# EAGLE design untitled (EAGLE 9.6.2)
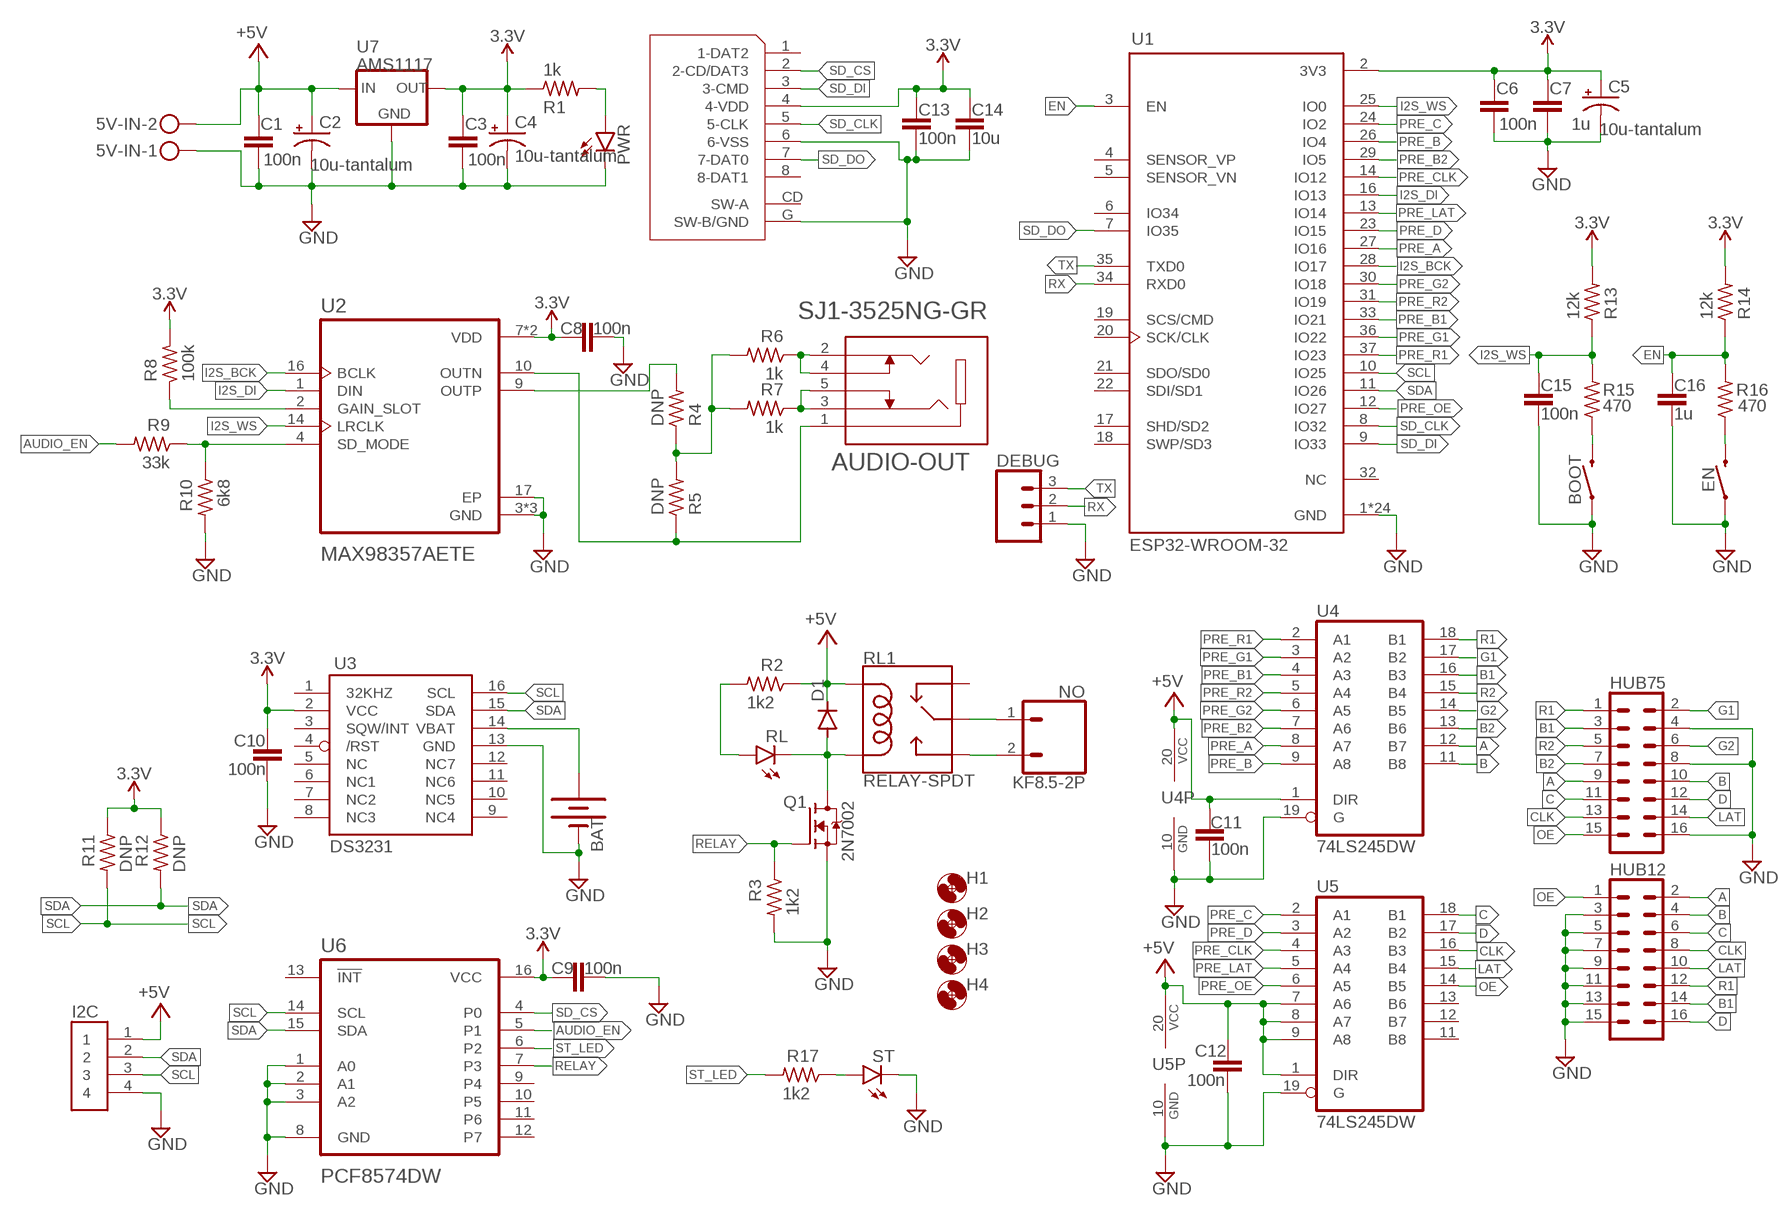
[diagram p0: schematic, sheet 1]

## Parts
5V-IN  MKDSN1,5/2-5,08  [MKDSN1,5/2-5,08]
AUDIO-OUT  SJ1-3525NG-GR  [CUI_SJ1-3525NG-GR]
BAT  BATTERY-20MM_PTH_KIT  [BATTCOM_20MM_PTH_KIT]
BOOT  MOMENTARY-SWITCH-SPST-SMD-6.0X3.5MM  [TACTILE_SWITCH_SMD_6.0X3.5MM]
C1  100n  C-EUC0603K  [C0603K]
C2  10u-tantalum  CPOL-USCT3528  [CT3528]
C3  100n  C-EUC0603K  [C0603K]
C4  10u-tantalum  CPOL-USCT3528  [CT3528]
C5  10u-tantalum  CPOL-USCT3528  [CT3528]
C6  100n  C-EUC0603K  [C0603K]
C7  1u  C-EUC0603K  [C0603K]
C8  100n  C-EUC0603K  [C0603K]
C9  100n  C-EUC0603K  [C0603K]
C10  100n  C-EUC0603K  [C0603K]
C11  100n  C-EUC0603K  [C0603K]
C12  100n  C-EUC0603K  [C0603K]
C13  100n  C-EUC0603K  [C0603K]
C14  10u  C-EUC0603K  [C0603K]
C15  100n  C-EUC0603K  [C0603K]
C16  1u  C-EUC0603K  [C0603K]
D1  DIODE-DO-214AC  [DO-214AC]
DEBUG  CONN_03  [1X03]
EN  MOMENTARY-SWITCH-SPST-SMD-6.0X3.5MM  [TACTILE_SWITCH_SMD_6.0X3.5MM]
H1  MOUNT-HOLE3.2  [3,2]
H2  MOUNT-HOLE3.2  [3,2]
H3  MOUNT-HOLE3.2  [3,2]
H4  MOUNT-HOLE3.2  [3,2]
HUB12  CONN_08X2_SHROUD  [2X8-SHROUDED_LOCK]
HUB75  CONN_08X2_SHROUD  [2X8-SHROUDED_LOCK]
I2C  B4B-XH-A(LF)(SN)  [JST_B4B-XH-A(LF)(SN)]
NO  KF8.5-2P  KF7.62-2P  [KF7.62]
PWR  LEDCHIP-LED0805  [CHIP-LED0805]
Q1  2N7002  [SOT95P240X111-3N]
R1  1k  R-US_R0603  [R0603]
R2  1k2  R-US_R0603  [R0603]
R3  1k2  R-US_R0603  [R0603]
R4  DNP  R-US_R0603  [R0603]
R5  DNP  R-US_R0603  [R0603]
R6  1k  R-US_R0603  [R0603]
R7  1k  R-US_R0603  [R0603]
R8  100k  R-US_R0603  [R0603]
R9  33k  R-US_R0603  [R0603]
R10  6k8  R-US_R0603  [R0603]
R11  DNP  R-US_R0603  [R0603]
R12  DNP  R-US_R0603  [R0603]
R13  12k  R-US_R0603  [R0603]
R14  12k  R-US_R0603  [R0603]
R15  470  R-US_R0603  [R0603]
R16  470  R-US_R0603  [R0603]
R17  1k2  R-US_R0603  [R0603]
RL  LEDCHIP-LED0805  [CHIP-LED0805]
RL1  RELAY-SPDT  [RELAY_G5LE]
ST  LEDCHIP-LED0805  [CHIP-LED0805]
U1  ESP32-WROOM-32  [MODULE_ESP32-WROOM-32]
U2  MAX98357AETE  [QFN50P300X300X80-17N]
U3  DS3231/SO  [SO16W]
U4  74LS245DW  [SO20W]
U5  74LS245DW  [SO20W]
U6  PCF8574DW  [SOIC127P1030X265-16N]
U7  AMS1117  [SOT89R]
μSD  112J-TDAR-R01  [112J-TDAR-R01]

## Nets
3.3V: C3.1 C4.+ C5.+ C6.1 C7.1 C8.1 C9.1 C10.2 C13.2 C14.2 R1.1 R8.2 R11.1 R12.1 R13.2 R14.2 U1.2(3V3) U2.7(VDD) U2.8(VDD) U3.2(VCC) U6.16(VCC) U7.3(OUT) U7.4(OUT) μSD.4(4-VDD)
+5V: 5V-IN.2 C1.1 C2.+ C11.1 C12.2 D1.C I2C.1 R2.1 RL1.2(COIL1) U4.1(DIR) U4.20(VCC) U5.1(DIR) U5.7(A6) U5.8(A7) U5.9(A8) U5.20(VCC) U7.1(IN)
A: HUB12.2 HUB75.9 U4.12(B7)
AUDIO_EN: R9.2 U6.5(P1)
B: HUB12.4 HUB75.10 U4.11(B8)
B1: HUB12.14 HUB75.3 U4.16(B3)
B2: HUB75.7 U4.13(B6)
C: HUB12.6 HUB75.11 U5.18(B1)
CLK: HUB12.8 HUB75.13 U5.16(B3)
D: HUB12.16 HUB75.12 U5.17(B2)
EN: C16.2 R14.1 R16.2 U1.3(EN)
G1: HUB75.2 U4.17(B2)
G2: HUB75.6 U4.14(B5)
GND: 5V-IN.1 BAT.2(-) BOOT.1 C1.2 C2.- C3.2 C4.- C5.- C6.2 C7.2 C8.2 C9.2 C10.1 C11.2 C12.1 C13.1 C14.1 C15.1 C16.1 DEBUG.1 EN.1 HUB12.3 HUB12.5 HUB12.7 HUB12.9 HUB12.11 HUB12.13 HUB12.15 HUB75.4 HUB75.8 HUB75.16 I2C.4 PWR.C Q1.2(S) R3.2 R10.2 ST.C U1.1(GND) U1.15(GND) U1.38(GND) U1.39_1(GND) U1.39_2(GND) U1.39_3(GND) U1.39_4(GND) U1.39_5(GND) U1.39_6(GND) U1.39_7(GND) U1.39_8(GND) U1.39_9(GND) U1.39_10(GND) U1.39_11(GND) U1.39_12(GND) U1.39_13(GND) U1.39_14(GND) U1.39_15(GND) U1.39_16(GND) U1.39_17(GND) U1.39_18(GND) U1.39_19(GND) U1.39_20(GND) U1.39_21(GND) U2.3(GND) U2.11(GND) U2.15(GND) U2.17(EP) U3.13(GND) U4.10(GND) U4.19(G) U5.10(GND) U5.19(G) U6.1(A0) U6.2(A1) U6.3(A2) U6.8(GND) U7.2(GND) μSD.6(6-VSS) μSD.G(SW-B/GND)
I2S_BCK: U1.28(IO17) U2.16(BCLK)
I2S_DI: U1.16(IO13) U2.1(DIN)
I2S_WS: C15.2 R13.1 R15.2 U1.25(IO0) U2.14(LRCLK)
LAT: HUB12.10 HUB75.14 U5.15(B4)
N$1: NO.1 RL1.1(MAIN)
N$2: NO.2 RL1.3(NO)
N$3: R4.2 U2.9(OUTP)
N$4: PWR.A R1.2
N$5: AUDIO-OUT.1 R5.1 U2.10(OUTN)
N$6: R4.1 R5.2 R6.2 R7.2
N$7: R8.1 U2.2(GAIN_SLOT)
N$8: AUDIO-OUT.3 AUDIO-OUT.5 R7.1
N$9: R9.1 R10.1 U2.4(SD_MODE)
N$10: AUDIO-OUT.2 AUDIO-OUT.4 R6.1
N$11: BAT.1(+) U3.14(VBAT)
N$13: EN.2 R16.1
N$14: BOOT.2 R15.1
N$15: R17.1 ST.A
N$61: D1.A Q1.3(D) RL1.5(COIL2) RL.C
N$65: R2.2 RL.A
OE: HUB12.1 HUB75.15 U5.14(B5)
PRE_A: U1.27(IO16) U4.8(A7)
PRE_B: U1.26(IO4) U4.9(A8)
PRE_B1: U1.33(IO21) U4.4(A3)
PRE_B2: U1.29(IO5) U4.7(A6)
PRE_C: U1.24(IO2) U5.2(A1)
PRE_CLK: U1.14(IO12) U5.4(A3)
PRE_D: U1.23(IO15) U5.3(A2)
PRE_G1: U1.36(IO22) U4.3(A2)
PRE_G2: U1.30(IO18) U4.6(A5)
PRE_LAT: U1.13(IO14) U5.5(A4)
PRE_OE: U1.12(IO27) U5.6(A5)
PRE_R1: U1.37(IO23) U4.2(A1)
PRE_R2: U1.31(IO19) U4.5(A4)
R1: HUB12.12 HUB75.1 U4.18(B1)
R2: HUB75.5 U4.15(B4)
RELAY: Q1.1(G) R3.1 U6.7(P3)
RX: DEBUG.2 U1.34(RXD0)
SCL: I2C.3 R11.2 U1.10(IO25) U3.16(SCL) U6.14(SCL)
SD_CLK: U1.8(IO32) μSD.5(5-CLK)
SD_CS: U6.4(P0) μSD.2(2-CD/DAT3)
SD_DI: U1.9(IO33) μSD.3(3-CMD)
SD_DO: U1.7(IO35) μSD.7(7-DAT0)
SDA: I2C.2 R12.2 U1.11(IO26) U3.15(SDA) U6.15(SDA)
ST_LED: R17.2 U6.6(P2)
TX: DEBUG.3 U1.35(TXD0)
Unconnected: RL1.4(NC) U1.4(SENSOR_VP) U1.5(SENSOR_VN) U1.6(IO34) U1.17(SHD/SD2) U1.18(SWP/SD3) U1.19(SCS/CMD) U1.20(SCK/CLK) U1.21(SDO/SD0) U1.22(SDI/SD1) U1.32(NC) U3.1(32KHZ) U3.3(SQW/INT) U3.4(/RST) U3.5(NC) U3.6(NC1) U3.7(NC2) U3.8(NC3) U3.9(NC4) U3.10(NC5) U3.11(NC6) U3.12(NC7) U5.11(B8) U5.12(B7) U5.13(B6) U6.9(P4) U6.10(P5) U6.11(P6) U6.12(P7) U6.13(!INT) μSD.1(1-DAT2) μSD.8(8-DAT1) μSD.CD(SW-A)

## Library data of the parts
5V-IN = con-phoenix-508:MKDSN1,5/2-5,08: MKDSN 1,5/ 2-5,08 Printklemme Nennstrom: 13,5 A Nennspannung: 250 V Rastermaß: 5,08 mm Polzahl: 2 Anschlussart: Schraubanschluss Montage: Löten Anschlussrichtung Leiter/Platine: 0 ° Artikelnummer: 1729128 Source: http://eshop.phoenixcontact.com .. 1729128.pdf
AUDIO-OUT = SJ1-3525NG-GR:SJ1-3525NG-GR: 3.5 mm Right-Angle Stereo Jack, 5 Pin PCB Mount, Isolated Ground, Green Check availability <https://pricing.snapeda.com/parts/SJ1-3525NG-GR/CUI%20Devices/view-part?ref=eda>; AVAILABILITY: In Stock; CUI_PURCHASE_URL: https://www.cuidevices.com/product/interconnect/connectors/audio-connectors/jacks/sj1-352xng-series?utm_source=snapeda.com&utm_medium=referral&utm_campaign=snapedaBOM; DESCRIPTION: 3.5 mm, Stereo, Right Angle, Through Hole, Isolated Ground, 3 Conductors, 0~2 Internal Switches, Audio Jack Connector; MF: CUI Devices; MP: SJ1-3525NG-GR; PACKAGE: None; PRICE: None; PURCHASE-URL: https://pricing.snapeda.com/search/part/SJ1-3525NG-GR/?ref=eda
BAT = SparkFun-Batteries:BATTERY: Battery - Single Cell A variety of battery chemistries, sizes, and footprints. Device List: 20MM_PTH - Coin Cell Battery Holder - 20mm (PTH) <https://www.sparkfun.com/products/783> 20MM_PTH_KIT- Coin Cell battery Holder - 20 mm (PTH) <http://www.sparkfun.com/products/783>kit version with special mask 6.8MM_PTH - Coin Cell Battery Holder - 6.8MM(SMD) <https://www.digikey.com/product-detail/en/seiko-instruments/MS621FE-FL11E/728-1057-ND/1889208?WT.srch=1&gclid=CNOQ5a6LzdQCFZS2wAodXCkE0g> 12MM_SMD - Coin Cell Battery Holder - 12mm (SMD) <https://www.sparkfun.com/products/10592> 12MM_PTH - Coin Cell Battery Holder - 12mm (PTH) <https://www.sparkfun.com/products/7948> 20MM_SMD - 20mm Coin Cell Battery Holder (SMD) (2 legs) Used on the Big Time Watch Kit <https://www.sparkfun.com/products/11734> 20MM_SMD_4LEGS - Coin Cell Battery Holder - 20mm (SMD) <https://www.sparkfun.com/products/11892> 20MM_SMD_4LEGS_OVERPASTE - Coin Cell Battery Holder - 20mm (SMD) <https://www.sparkfun.com/products/11892> (Over-paste on the legs) 24.5MM_PTH - Coin Cell Battery Holder - 24.5mm (PTH) <https://www.sparkfun.com/products/8863> 9V - 9V Battery Holder - PC Mount Used on the SparkFun SparkPunk Sound Kit <https://www.sparkfun.com/products/11177> and SparkFun SparkPunk Sequencer Kit <https://www.sparkfun.com/products/12707> 18650 - Battery Holder - 18650 (PTH) <https://www.sparkfun.com/products/13113> AA - Battery Holder - 1xAA (PTH) <https://www.sparkfun.com/products/7949> AAA - Battery Holder - 1xAAA (PTH) <https://www.sparkfun.com/products/12718> AA_KIT - Battery Holder - 1xAA (PTH) <https://www.sparkfun.com/products/7949> Special kit package - pads only have exposed copper on one side of the board. AAA_KIT - Battery Holder - 1xAAA (PTH) <https://www.sparkfun.com/products/12718> Special kit package - pads only have exposed copper on one side of the board.
BOOT EN = SparkFun-Switches:MOMENTARY-SWITCH-SPST: Momentary Switch (Pushbutton) - SPST Normally-open (NO) SPST momentary switches (buttons, pushbuttons). Variants PTH-12MM - 12mm square, through-hole Momentary Pushbutton Switch - 12mm Square <https://www.sparkfun.com/products/9190> (COM-09190) PTH-6.0MM, PTH-6.0MM-KIT - 6.0mm square, through-hole Mini Pushbutton Switch <https://www.sparkfun.com/products/97> (COM-00097) KIT package intended for soldering kit's - only one side of pads' copper is exposed. PTH-RIGHT-ANGLE-KIT - Right-angle, through-hole Right Angle Tactile Button <https://www.sparkfun.com/products/10791> - Used on SparkFun BigTime Watch Kit <https://www.sparkfun.com/products/11734> SMD-12MM - 12mm square, surface-mount Tactile Button - SMD (12mm) <https://www.sparkfun.com/products/12993> (COM-12993) Used on SparkFun PicoBoard <https://www.sparkfun.com/products/11888> SMD-4.5MM - 4.5mm Square Trackball Switch Used on SparkFun Blackberry Trackballer Breakout <https://www.sparkfun.com/products/13169> SMD-4.6MMX2.8MM - 4.60mm x 2.80mm, surface mount Used on SparkFun Pro Micro - RP2040 <https://www.sparkfun.com/products/17717> SMD-5.2MM, SMD-5.2-REDUNDANT - 5.2mm square, surface-mount Mini Pushbutton Switch - SMD <https://www.sparkfun.com/products/8720> (COM-08720) Used on Arduino Pro Mini <https://www.sparkfun.com/products/11114> REDUNDANT package connects both switch circuits together SMD-6.0X3.5MM - 6.0 x 3.5mm, surface mount Momentary Reset Switch SMD <https://www.sparkfun.com/products/8229> (COM-08229) SMD-6.2MM-TALL - 6.2mm square, surface mount Tactile Button - SMD (6mm) <https://www.sparkfun.com/products/12992> Used on SparkFun Digital Sandbox <https://www.sparkfun.com/products/12651> SMD-RIGHT-ANGLE - Right-angle, surface mount Used on SparkFun Block for Intel® Edison - Arduino <https://www.sparkfun.com/products/13036>; PROD_ID: SWCH-14278; SF_SKU: COM-08229
C1 C3 C6-C16 = rcl:C-EU: CAPACITOR, European symbol; SPICEPREFIX: C
C2 C4 C5 = rcl:CPOL-US: POLARIZED CAPACITOR, American symbol; SPICEPREFIX: C
D1 = diode:DIODE-: DIODE
DEBUG = SparkFun-Connectors:CONN_03: Multi connection point. Often used as Generic Header-pin footprint for 0.1 inch spaced/style header connections On any of the 0.1 inch spaced packages, you can populate with these: Break Away Headers - Straight <https://www.sparkfun.com/products/116> (PRT-00116) Break Away Male Headers - Right Angle <https://www.sparkfun.com/products/553> (PRT-00553) Female Headers <https://www.sparkfun.com/products/115> (PRT-00115) Break Away Headers - Machine Pin <https://www.sparkfun.com/products/117> (PRT-00117) Break Away Female Headers - Swiss Machine Pin <https://www.sparkfun.com/products/743> (PRT-00743) Stackable Header - 3 Pin (Female, 0.1") <https://www.sparkfun.com/products/13875> (PRT-13875) For SCREWTERMINALS and SPRING TERMINALS visit here: Screw Terimnals on SparkFun.com <https://www.sparkfun.com/search/results?term=Screw+Terminals> (5mm/3.5mm/2.54mm spacing) This device is also useful as a general connection point to wire up your design to another part of your project. Our various solder wires solder well into these plated through hole pads. Hook-Up Wire - Assortment (Stranded, 22 AWG) <https://www.sparkfun.com/products/11375> (PRT-11375) Hook-Up Wire - Assortment (Solid Core, 22 AWG) <https://www.sparkfun.com/products/11367> (PRT-11367) View the entire wire category on our website here <https://www.sparkfun.com/categories/141> Special notes: Molex polarized connector foot print use with SKU : PRT-08232 with associated crimp pins and housings.; PROD_ID: XXX-00000; VALUE: 455-1750-1-ND
H1-H4 = holes:MOUNT-HOLE: MOUNTING HOLE with drill center marker
HUB12 = SparkFun-Connectors:CONN_08X2: Multi connection point. Often used as Generic Header-pin footprint for 0.1 inch spaced/style header connections You can populate with any combo of single row headers, but if you'd like an exact match, check this: Header - 2x8 (Male, 0.1") <https://www.sparkfun.com/products/13156> (PRT-13156) On any of the 0.1 inch spaced packages, you can populate with these: Break Away Headers - Straight <https://www.sparkfun.com/products/116> (PRT-00116) Break Away Male Headers - Right Angle <https://www.sparkfun.com/products/553> (PRT-00553) Female Headers <https://www.sparkfun.com/products/115> (PRT-00115) Break Away Headers - Machine Pin <https://www.sparkfun.com/products/117> (PRT-00117) Break Away Female Headers - Swiss Machine Pin <https://www.sparkfun.com/products/743> (PRT-00743)
HUB75 = SparkFun-Connectors:CONN_08X2: Multi connection point. Often used as Generic Header-pin footprint for 0.1 inch spaced/style header connections You can populate with any combo of single row headers, but if you'd like an exact match, check this: Header - 2x8 (Male, 0.1") <https://www.sparkfun.com/products/13156> (PRT-13156) On any of the 0.1 inch spaced packages, you can populate with these: Break Away Headers - Straight <https://www.sparkfun.com/products/116> (PRT-00116) Break Away Male Headers - Right Angle <https://www.sparkfun.com/products/553> (PRT-00553) Female Headers <https://www.sparkfun.com/products/115> (PRT-00115) Break Away Headers - Machine Pin <https://www.sparkfun.com/products/117> (PRT-00117) Break Away Female Headers - Swiss Machine Pin <https://www.sparkfun.com/products/743> (PRT-00743); SPICEPREFIX: X
I2C = hotberry:B4B-XH-A(LF)(SN): XH Series 4 Position 2.5 mm Pitch Through Hole Crimp Top Entry Shrouded Header; MANUFACTURER: JST Sales America Inc; PARTREV: NA; STANDARD: Manufacturer Recommendation
NO = SparkFun-Connectors:KF7.62-2P
PWR RL ST = led:LED: LED OSRAM: - CHIPLED LG R971, LG N971, LY N971, LG Q971, LY Q971, LO R971, LY R971 LH N974, LH R974 LS Q976, LO Q976, LY Q976 LO Q996 - Hyper CHIPLED LW Q18S LB Q993, LB Q99A, LB R99A - SideLED LS A670, LO A670, LY A670, LG A670, LP A670 LB A673, LV A673, LT A673, LW A673 LH A674 LY A675 LS A676, LA A676, LO A676, LY A676, LW A676 LS A679, LY A679, LG A679 - Hyper Micro SIDELED® LS Y876, LA Y876, LO Y876, LY Y876 LT Y87S - SmartLED LW L88C, LW L88S LB L89C, LB L89S, LG L890 LS L89K, LO L89K, LY L89K LS L896, LA L896, LO L896, LY L896 - TOPLED LS T670, LO T670, LY T670, LG T670, LP T670 LSG T670, LSP T670, LSY T670, LOP T670, LYG T670 LG T671, LOG T671, LSG T671 LB T673, LV T673, LT T673, LW T673 LH T674 LS T676, LA T676, LO T676, LY T676, LB T676, LH T676, LSB T676, LW T676 LB T67C, LV T67C, LT T67C, LS T67K, LO T67K, LY T67K, LW E67C LS E67B, LA E67B, LO E67B, LY E67B, LB E67C, LV E67C, LT E67C LW T67C LS T679, LY T679, LG T679 LS T770, LO T770, LY T770, LG T770, LP T770 LB T773, LV T773, LT T773, LW T773 LH T774 LS E675, LA E675, LY E675, LS T675 LS T776, LA T776, LO T776, LY T776, LB T776 LHGB T686 LT T68C, LB T68C - Hyper Mini TOPLED® LB M676 - Mini TOPLED Santana® LG M470 LS M47K, LO M47K, LY M47K Source: http://www.osram.convergy.de LUXEON: - LUMILED® LXK2-PW12-R00, LXK2-PW12-S00, LXK2-PW14-U00, LXK2-PW14-V00 LXK2-PM12-R00, LXK2-PM12-S00, LXK2-PM14-U00 LXK2-PE12-Q00, LXK2-PE12-R00, LXK2-PE12-S00, LXK2-PE14-T00, LXK2-PE14-U00 LXK2-PB12-K00, LXK2-PB12-L00, LXK2-PB12-M00, LXK2-PB14-N00, LXK2-PB14-P00, LXK2-PB14-Q00 LXK2-PR12-L00, LXK2-PR12-M00, LXK2-PR14-Q00, LXK2-PR14-R00 LXK2-PD12-Q00, LXK2-PD12-R00, LXK2-PD12-S00 LXK2-PH12-R00, LXK2-PH12-S00 LXK2-PL12-P00, LXK2-PL12-Q00, LXK2-PL12-R00 Source: www.luxeon.com KINGBRIGHT: KA-3528ASYC Source: www.kingbright.com
Q1 = hotberry:2N7002: N-Channel 60V 280mA (Ta) 350mW (Ta) Surface Mount SOT-23-3 (TO-236) Check availability <https://pricing.snapeda.com/parts/2N7002/ON%20Semiconductor/view-part?ref=eda>; AVAILABILITY: In Stock; DESCRIPTION: N-Channel 60V 280mA (Ta) 350mW (Ta) Surface Mount SOT-23-3 (TO-236); MF: ON Semiconductor; MP: 2N7002; PACKAGE: SOT-23-3 ON Semiconductor; PRICE: None; PURCHASE-URL: https://pricing.snapeda.com/search/part/2N7002/?ref=eda
R1-R17 = rcl:R-US_: RESISTOR, American symbol; SPICEPREFIX: R
RL1 = SparkFun-Electromechanical:RELAY-SPDT: SPDT Electromechanical Relay Single-pole, double-throw sealed relays. When current is applied to the coil, it throws a simple changeover switch, terminating the connection from the NC contact to ground and closing the NO contact. Use them to switch high voltage/high current devices. SparkFun Products JQX-15F: Relay SPDT Sealed - 20A <https://www.sparkfun.com/products/10924> (COM-10924) JZC-11F: Relay SPDT Sealed <https://www.sparkfun.com/products/100> (COM-00100); PROD_ID: COMP-14214
U1 = Mynd:ESP32-WROOM-32; MANUFACTURER: Espressif Systems; MAXIMUM_PACKAGE_HEIGHT: 3.2 mm; PARTREV: 2.9; STANDARD: Manufacturer Recommendations
U2 = Mynd:MAX98357AETE: None; AVAILABILITY: Unavailable; DESCRIPTION: Audio Amp Speaker 1-CH Mono Class-D 16-Pin TQFN EP T/R; MF: Maxim Integrated; MP: MAX98357AETE; PACKAGE: TQFN-16 Maxim; PRICE: None
U3 = Mynd:DS3231
U4 U5 = 74xx-us:74*245: Octal BUS TRANSCEIVER, 3-state
U6 = PCF8574DW:PCF8574DW: Check availability <https://pricing.snapeda.com/parts/PCF8574DW/Texas%20Instruments/view-part?ref=eda>; AVAILABILITY: In Stock; DESCRIPTION: Remote 8-Bit I/O Expander for I2C-Bus 16-SOIC -40 to 85; MF: Texas Instruments; MP: PCF8574DW; PACKAGE: SOIC-16 Texas Instruments; PRICE: None; PURCHASE-URL: https://pricing.snapeda.com/search/part/PCF8574DW/?ref=eda
U7 = v-reg:AMS1117
μSD = Mynd:112J-TDAR-R01

## Board
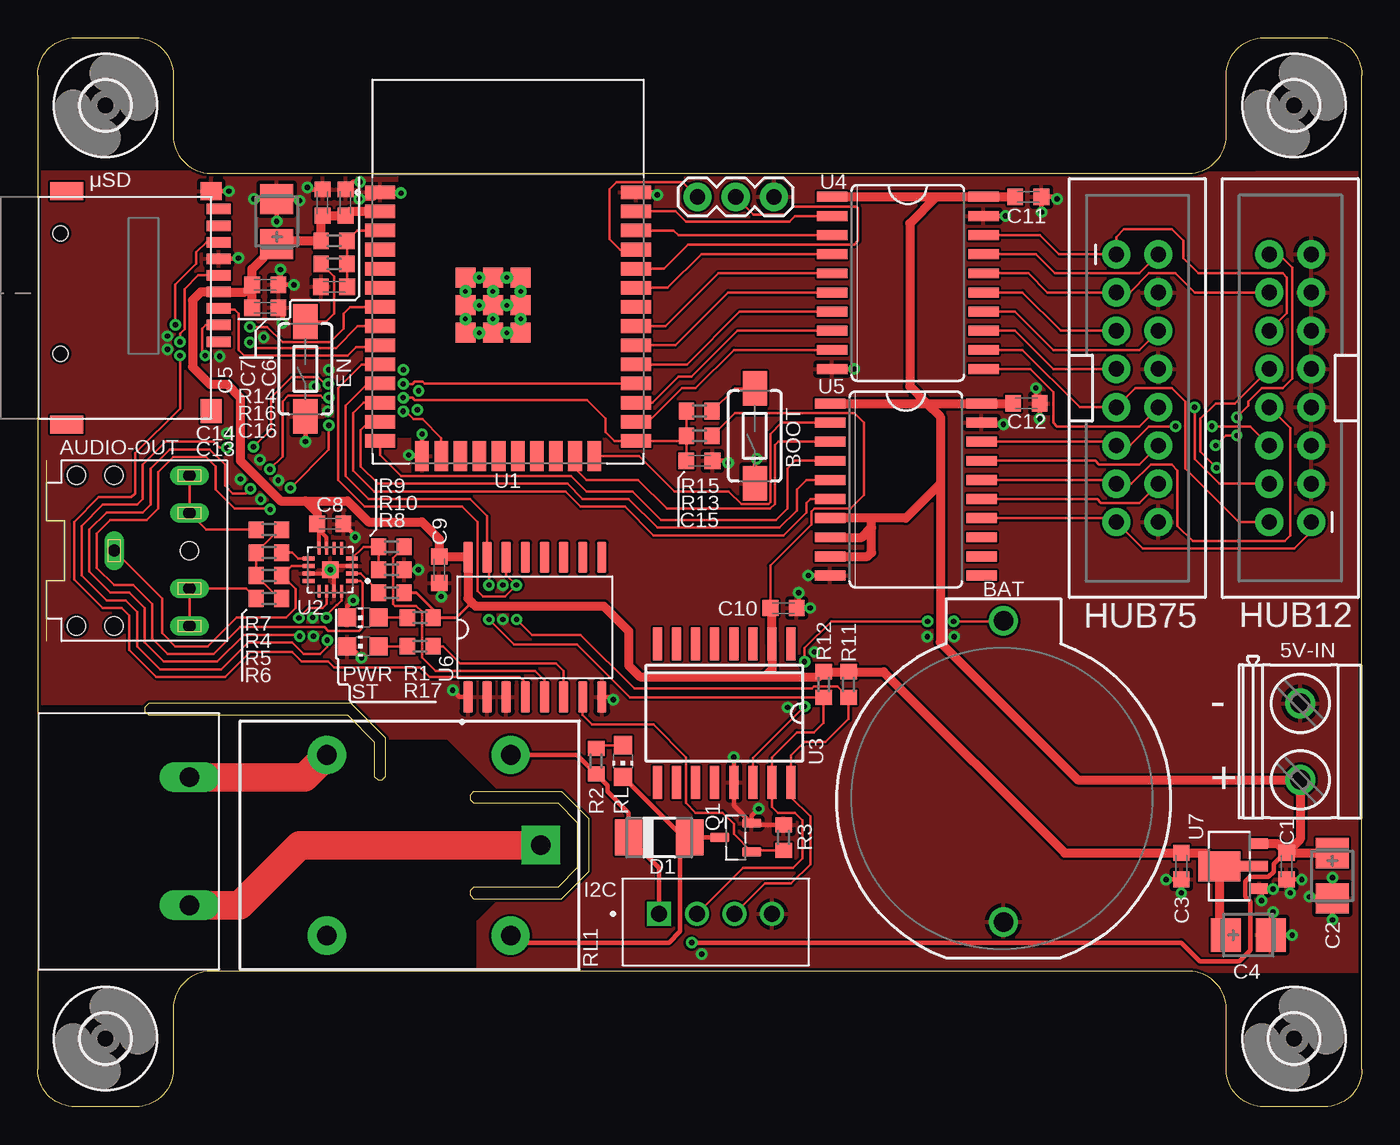
[diagram p1: board, top side]
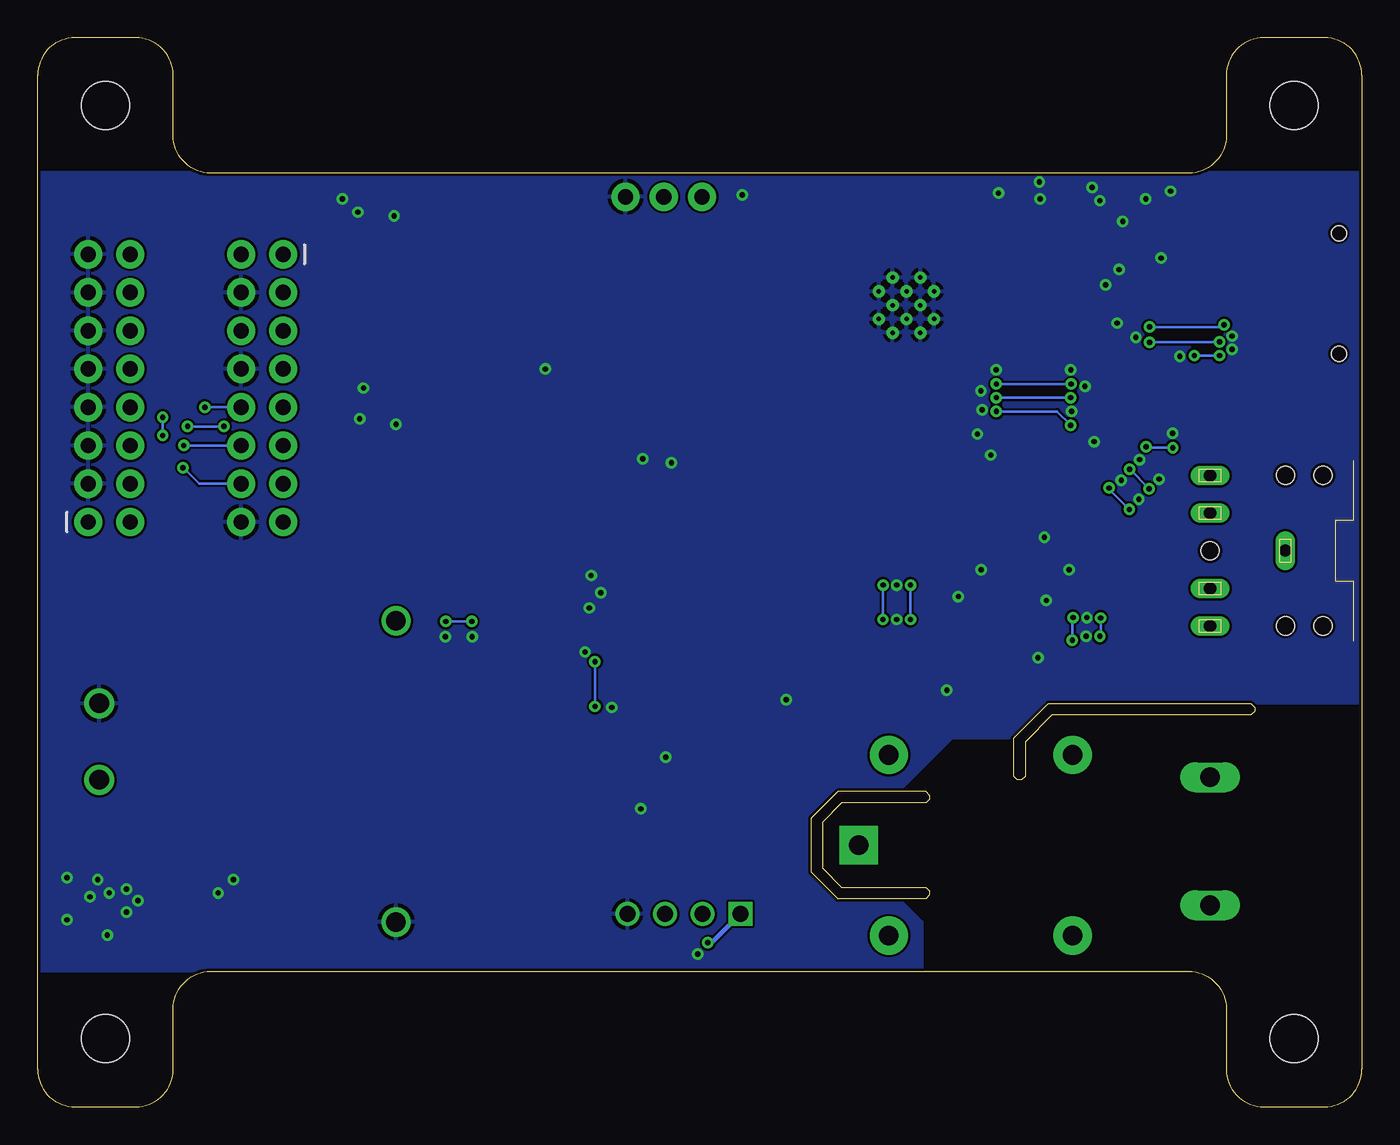
[diagram p2: board, bottom side, seen from below]

Size 87.94 x 71.01 mm. Coordinates in mm from the lower left corner, seen from the top.
Outline: 78.94,2.5 78.94,6.5 arc90 76.44,9 11.5,9 arc90 9,6.5 9,2.5 arc-90 6.5,0 2.5,0 arc-90 0,2.5 0,68.51 arc-90 2.5,71.01 6.5,71.01 arc-90 9,68.51 9,64.51 arc90 11.5,62.01 76.44,62.01 arc90 78.94,64.51 78.94,68.51 arc-90 81.44,71.01 85.44,71.01 arc-90 87.94,68.51 87.94,2.5 arc-90 85.44,0 81.44,0 arc-90 78.94,2.5
Outline: 7.37,26.02 20.57,26.02 22.35,24.24 22.35,21.95 22.61,21.7 22.86,21.7 23.11,21.95 23.11,24.49 20.83,26.78 7.37,26.78 7.11,26.53 7.11,26.27 7.37,26.02
Outline: 28.96,20.94 34.8,20.94 36.58,19.16 36.58,15.6 34.8,13.83 28.96,13.83 28.7,14.08 28.7,14.33 28.96,14.59 34.54,14.59 35.81,15.86 35.81,18.91 34.54,20.18 28.96,20.18 28.7,20.43 28.7,20.68 28.96,20.94
Copper layers (1*16): Top 0.035mm / dielectric 1.5mm / Bottom 0.035mm
Design rules "nextpcb *": minimum track width 6mil, minimum drill 0.3mm, track to track 6mil, track to pad 6mil, pad to pad 6mil, via to via 6mil, smd to smd 0mil, copper to edge 8mil, drill to drill 6mil, minimum pad ring 10mil, minimum via ring 8mil, stop-mask expansion 4mil, vias tented up to drill 25mil, thermal gap 10mil

### Footprints (pad centres in the part's own frame; a part is rotated, then mirrored left to right if it is on the bottom)
MKDSN1,5/2-5,08 = drill 1.3 pad 2: 1 -2.561,0.025; 2 2.519,0.025
CUI_SJ1-3525NG-GR = drill 0.8 long: 1 0,0; 2 5,-5; 3 5,5; 4 5,-2.5; 5 5,2.5 | hole 1.2: -2.5,5; 0,5; 5,0; -2.5,-5; 0,-5
BATTCOM_20MM_PTH_KIT = drill 1.3: 1 11.85,0; 2 -8.15,0
TACTILE_SWITCH_SMD_6.0X3.5MM = smd 2.3 x 1.6: 1 -3.15,0; 2 3.15,0
C0603K = smd 1.05 x 1.08: 1 -0.875,0; 2 0.875,0
CT3528 = smd 2 x 2.2: + -1.5,0; - 1.5,0
DO-214AC = smd 1.8 x 2.4: A 2.025,0; C -2.025,0
1X03 = drill 1.016 pad 1.88: 1 0,0; 2 2.54,0; 3 5.08,0
3,2 = hole 3.2: 0,0
2X8-SHROUDED_LOCK = drill 1.016 pad 1.88: 1 -1.397,8.89; 2 1.397,8.89; 3 -1.397,6.35; 4 1.397,6.35; 5 -1.397,3.81; 6 1.397,3.81; 7 -1.397,1.27; 8 1.397,1.27; 9 -1.397,-1.27; 10 1.397,-1.27; 11 -1.397,-3.81; 12 1.397,-3.81; 13 -1.397,-6.35; 14 1.397,-6.35; 15 -1.397,-8.89; 16 1.397,-8.89
JST_B4B-XH-A(LF)(SN) = drill 1.06 square: 1 0,0 | drill 1.06: 2 2.5,0; 3 5,0; 4 7.5,0
KF7.62 = drill 1.3 pad 2 long: 1 -4.25,-5.75; 2 4.25,-5.75
CHIP-LED0805 = smd 1.2 x 1.2: A 0,-1.05; C 0,1.05
SOT95P240X111-3N = smd 1.23 x 0.6: 1 -1.06,0.95; 2 -1.06,-0.95; 3 1.06,0
R0603 = smd 1 x 1.1: 1 -0.85,0; 2 0.85,0
RELAY_G5LE = drill 1.3 pad 2.54 square: 1 8.52,-0.005 | drill 1.3 pad 2.54: 2 6.52,5.995; 3 -5.68,5.995; 4 -5.68,-6.005; 5 6.52,-6.005
MODULE_ESP32-WROOM-32 = smd 2 x 0.9: 1 -8.5,5.26; 2 -8.5,3.99; 3 -8.5,2.72; 4 -8.5,1.45; 5 -8.5,0.18; 6 -8.5,-1.09; 7 -8.5,-2.36; 8 -8.5,-3.63; 9 -8.5,-4.9; 10 -8.5,-6.17; 11 -8.5,-7.44; 12 -8.5,-8.71; 13 -8.5,-9.98; 14 -8.5,-11.25; 25 8.5,-11.25; 26 8.5,-9.98; 27 8.5,-8.71; 28 8.5,-7.44; 29 8.5,-6.17; 30 8.5,-4.9; 31 8.5,-3.63; 32 8.5,-2.36; 33 8.5,-1.09; 34 8.5,0.18; 35 8.5,1.45; 36 8.5,2.72; 37 8.5,3.99; 38 8.5,5.26 | smd 0.9 x 2: 15 -5.715,-12.25; 16 -4.445,-12.25; 17 -3.175,-12.25; 18 -1.905,-12.25; 19 -0.635,-12.25; 20 0.635,-12.25; 21 1.905,-12.25; 22 3.175,-12.25; 23 4.445,-12.25; 24 5.715,-12.25 | smd 1.33 x 1.33: 39_1 -2.835,-0.405; 39_2 -1,-0.405; 39_3 0.835,-0.405; 39_4 -2.835,-2.24; 39_5 -1,-2.24; 39_6 0.835,-2.24; 39_7 -2.835,-4.075; 39_8 -1,-4.075; 39_9 0.835,-4.075 | drill 0.3 pad 0.61: 39_10 -1.917,-0.405; 39_11 -0.083,-0.405; 39_12 -2.835,-1.323; 39_13 -1,-1.323; 39_14 0.835,-1.323; 39_15 -1.917,-2.24; 39_16 -0.083,-2.24; 39_17 -2.835,-3.158; 39_18 -1,-3.158; 39_19 0.835,-3.158; 39_20 -1.917,-4.075; 39_21 -0.083,-4.075
QFN50P300X300X80-17N = smd 0.84 x 0.27: 1 -1.435,0.75; 2 -1.435,0.25; 3 -1.435,-0.25; 4 -1.435,-0.75; 9 1.435,-0.75; 10 1.435,-0.25; 11 1.435,0.25; 12 1.435,0.75 | smd 0.27 x 0.84: 5 -0.75,-1.435; 6 -0.25,-1.435; 7 0.25,-1.435; 8 0.75,-1.435; 13 0.75,1.435; 14 0.25,1.435; 15 -0.25,1.435; 16 -0.75,1.435 | smd 1.1 x 1.1: 17 0,0
SO16W = smd 0.6 x 2.2: 1 -4.445,-4.6; 2 -3.175,-4.6; 3 -1.905,-4.6; 4 -0.635,-4.6; 5 0.635,-4.6; 6 1.905,-4.6; 7 3.175,-4.6; 8 4.445,-4.6; 9 4.445,4.6; 10 3.175,4.6; 11 1.905,4.6; 12 0.635,4.6; 13 -0.635,4.6; 14 -1.905,4.6; 15 -3.175,4.6; 16 -4.445,4.6
SO20W = smd 0.66 x 2.032: 1 -5.715,-5.029; 2 -4.445,-5.029; 3 -3.175,-5.029; 4 -1.905,-5.029; 5 -0.635,-5.029; 6 0.635,-5.029; 7 1.905,-5.029; 8 3.175,-5.029; 9 4.445,-5.029; 10 5.715,-5.029; 11 5.715,5.029; 12 4.445,5.029; 13 3.175,5.029; 14 1.905,5.029; 15 0.635,5.029; 16 -0.635,5.029; 17 -1.905,5.029; 18 -3.175,5.029; 19 -4.445,5.029; 20 -5.715,5.029
SOIC127P1030X265-16N = smd 2.06 x 0.6: 1 -4.64,4.445; 2 -4.64,3.175; 3 -4.64,1.905; 4 -4.64,0.635; 5 -4.64,-0.635; 6 -4.64,-1.905; 7 -4.64,-3.175; 8 -4.64,-4.445; 9 4.64,-4.445; 10 4.64,-3.175; 11 4.64,-1.905; 12 4.64,-0.635; 13 4.64,0.635; 14 4.64,1.905; 15 4.64,3.175; 16 4.64,4.445
SOT89R = smd 0.7 x 1.1: 1 1.5,-1.75; 2 -1.5,-1.75 | smd 0.7 x 1.8: 3 0,-1.4 | smd 2 x 2.8: 4 0,0.9
112J-TDAR-R01 = smd 0.7 x 1.6: 1 7.2,10.5; 2 6.1,10.5; 3 5,10.5; 4 3.9,10.5; 5 2.8,10.5; 6 1.7,10.5; 7 0.6,10.5; 8 -0.5,10.5; CD -1.6,10.5 | smd 1.2 x 1.4: G -2.8,10 | smd 1.6 x 1.4: P$10 11.8,10 | smd 1.2 x 2.2: P$11 -2.8,0.4; P$12 12.7,0.4 | hole 1: 0,0; 8,0

### Placement (x,y rotation side)
5V-IN  83.82,24.24 270 top
AUDIO-OUT  5.08,36.94 0 top
BAT  64.13,20.43 90 top
BOOT  47.62,44.56 90 top
C1  82.93,15.98 270 top
C2  85.98,15.35 270 top
C3  75.95,15.98 270 top
C4  80.39,11.41 0 top
C5  15.88,58.78 90 top
C6  20.45,60.05 90 top
C7  18.92,60.05 90 top
C8  19.43,38.72 0 top
C9  26.67,35.67 270 top
C10  49.53,33.13 180 top
C11  65.79,60.43 0 top
C12  65.66,46.72 180 top
C13  15.11,53.07 180 top
C14  15.11,54.59 180 top
C15  43.94,42.91 180 top
C16  19.68,54.47 0 top
D1  41.27,17.89 0 top
DEBUG  48.89,60.43 180 top
EN  17.78,49 90 top
H1  4.5,66.51 0 top
H2  83.44,66.51 0 top
H3  4.5,4.53 0 top
H4  83.44,4.53 0 top
HUB12  83.19,47.73 180 top
HUB75  73.03,47.73 0 top
I2C  41.27,12.81 0 top
NO  4.32,17.64 90 top
PWR  21.59,32.49 90 top
Q1  46.35,17.89 180 top
R1  25.4,32.49 180 top
R2  37.08,22.97 90 top
R3  49.53,17.89 90 top
R4  15.37,36.81 0 top
R5  15.37,35.29 180 top
R6  15.37,33.76 0 top
R7  15.37,38.34 0 top
R8  23.5,34.15 0 top
R9  23.5,37.19 0 top
R10  23.5,35.67 0 top
R11  53.85,28.05 270 top
R12  52.2,28.05 270 top
R13  43.94,44.56 0 top
R14  19.68,57.51 180 top
R15  43.94,46.21 180 top
R16  19.68,55.99 0 top
R17  25.4,30.59 0 top
RL  38.86,22.97 180 top
RL1  24.89,17.38 0 top
ST  21.59,30.59 90 top
U1  31.24,55.48 0 top
U2  19.43,35.67 180 top
U3  45.59,26.14 180 top
U4  57.78,54.72 270 top
U5  57.66,41 270 top
U6  33.02,31.86 90 top
U7  79.38,15.98 90 top
μSD  1.52,58.02 270 top

### Tracks (layer width: path | path; a pad name or v marks a point on that pad's centre or on a via)
3.3V
  Top 0.152: R13.2 46.32,46.08 54.23,46.08 54.86,45.45 54.86,40.62 53.98,39.73 51.59,39.73 51.38,39.52 51.38,38.67 48.66,35.94 C10.2
  Top 0.203: R8.2 25.15,34.15 26.25,33.04 R1.1 27.81,32.49 28.83,33.51
  Top 0.254: U2.8 18.68,38.32 | C8.1 18.68,38.59 18.68,38.32 | U2.7 19.18,37.82 18.68,38.32
  Top 0.61: C14.2 13.77,54.12 μSD.4 10.83,54.12 10.29,53.58 10.29,49.13 11.43,47.99 12.57,47.99 13.46,47.1 13.46,42.91 16.13,40.24 17.78,40.24 | C13.2 C14.2 | C14.2 14.24,55.65 C5.+ 16.11,57.51 R14.2 18.84,59.09 C7.1 C6.1 20.74,59.47 U1.2 | 17.78,40.24 18.56,39.47 C8.1 | 17.78,40.24 20.57,40.24 21.97,38.84 25.53,38.84 26.67,37.7 C9.1 28.53,36.54 U6.16 28.57,33.76 28.83,33.51 29.08,33.26 37.59,33.26 39.24,31.61 39.24,29.32 40.01,28.56 48.26,28.56 | 48.26,28.56 48.77,29.07 U3.2 48.77,33.02 C10.2 | 48.26,28.56 51.86,28.56 R12.1 R11.1 56.17,28.9 68.21,16.86 C3.1 77.6,16.86 U7.4 | U7.4 78.47,11.83 C4.+ | U7.3 U7.4
+5V  (via drill 0.35)
  Top 0.305: I2C.1 41.27,15.86 D1.C 39.25,19.53 37.85,20.94 37.85,21.36 R2.1 35.83,23.38 RL1.2 | v43.43,10.9 75.95,10.9 77.19,9.66 79.78,9.66 80.52,10.4 80.52,13.63 80.19,13.96 80.19,14.96 80.5,15.27 81.74,15.27 82.09,15.61 82.09,16.14 82.8,16.86 C1.1
  Top 0.61: U4.1 59.69,60.43 | 59.69,60.43 U4.20 C11.1 | 59.69,60.43 57.91,58.66 57.91,47.86 59.05,46.72 | 59.05,46.72 U5.20 C12.2 | U5.1 59.05,46.72 | 59.05,46.72 59.94,45.83 59.94,41.38 | 55.37,39.1 57.66,39.1 59.94,41.38 | 55.37,39.1 U5.7 | U5.8 54.74,37.83 55.37,38.46 | 55.37,38.46 55.37,39.1 | U5.9 55.12,36.56 55.37,36.81 55.37,38.46 | C1.1 83.84,17.77 5V-IN.2 69.07,21.72 59.94,30.84 59.94,41.38 | C1.1 C2.+ | U7.1 82.31,17.48 C1.1
  Bottom 0.305: I2C.1 43.18,10.9 v43.43,10.9
A
  Top 0.152: U4.12 65.41,50.27 69.22,46.46 HUB75.9 72.9,47.73 75.31,47.73 76.2,46.85 76.2,42.4 79.76,38.84 HUB12.2
AUDIO_EN
  Top 0.152: U6.5 33.66,28.3 33.02,28.94 26.42,28.94 25.52,29.83 25.52,32.9 25.14,33.27 23.73,33.27 23.62,33.39 23.62,36.46 R9.2
B  (via drill 0.35)
  Top 0.152: U4.11 65.91,49 67.44,47.48 67.44,45.45 67.69,45.19 73.15,45.19 HUB75.10 | v76.84,46.46 76.84,43.04 78.49,41.38 HUB12.4
  Bottom 0.152: HUB75.10 v76.84,46.46
B1
  Top 0.152: U4.16 65.79,55.35 67.06,54.08 HUB75.3 72.52,54.08 73.79,55.35 75.56,55.35 76.84,54.08 HUB12.14
B2
  Top 0.152: U4.13 64.9,51.55 67.44,49 HUB75.7
C  (via drill 0.35)
  Top 0.152: U5.18 71.37,44.18 HUB75.11 72.52,43.92 73.79,45.19 v75.56,45.19 | HUB12.6 80.52,45.19 v77.98,45.19
  Bottom 0.152: v77.98,45.19 v75.56,45.19
CLK
  Top 0.152: U5.16 71.37,41.64 HUB75.13 72.64,41.38 73.91,42.65 75.31,42.65 75.69,42.27 75.69,38.59 76.71,37.57 82.8,37.57 83.19,37.96 83.19,45.07 HUB12.8
D  (via drill 0.35)
  Top 0.152: U5.17 70.23,42.91 70.48,42.65 73.15,42.65 HUB75.12 | v78.23,43.92 78.9,44.59 v79.63,44.59 | v79.63,45.8 80.39,46.56 80.39,46.85 81.28,47.73 82.68,47.73 83.31,48.37 83.31,55.74 82.42,56.62 HUB12.16
  Bottom 0.152: HUB75.12 v78.23,43.92 | v79.63,44.59 v79.63,45.8
EN
  Top 0.152: C16.2 20.54,54.49 R16.2 R14.1 21.22,58.2 U1.3
G1
  Top 0.152: U4.17 66.29,56.62 67.56,55.35 73.15,55.35 HUB75.2
G2
  Top 0.152: U4.14 64.9,52.81 67.44,50.27 73.15,50.27 HUB75.6
GND  (via drill 0.35)
  Top 0.254: U2.11 19.18,35.42 U2.17 19.49,35.61 | U2.15 19.68,35.42 19.49,35.61 | U2.3 19.81,35.92 19.49,35.61
  Top 0.305: R3.2 47.52,18.74 Q1.2 | Q1.2 46.23,20.03 U3.13 v46.23,23.22 | U6.8 38.04,27.22 v38.23,27.03 | Q1.2 47.41,19.33 v47.88,19.79 | U6.1 28.01,27.22 v27.56,27.67 | PWR.C 20.54,33.22 v20.95,33.64 | C8.2 21.08,37.94 v21.08,37.83 | ST.C 20.75,30.59 v21.51,29.83 | R10.2 v25.27,35.67 | C9.2 26.8,34.67 v26.8,33.89 | v25.53,44.69 U1.15 24.7,43.23 v24.64,43.29 | EN.1 v17.78,44.18 | v17.02,54.59 C14.1 16.13,54.73 v16.13,55.61 | C13.1 16.26,52.8 v16.26,52.05 | μSD.6 13.29,56.32 v13.34,56.37 | μSD.G v12.69,60.82 v12.7,60.82 | C5.- 14.38,60.28 v14.35,60.31 | C5.- v15.88,58.81 | C5.- 17.3,60.28 v17.4,60.18 | C7.2 18.05,60.93 v17.91,61.07 | C6.2 20.95,61.43 v21.41,61.43 | v24.13,60.69 24.08,60.74 U1.1 22.31,60.31 v21.36,60.31 | U1.38 40.97,60.74 v41.15,60.56 | v74.93,15.1 74.94,15.11 C3.2 v75.95,14.21 | v81.28,13.7 81.28,14.33 U7.2 82.02,14.48 v82.04,14.46 | v83.95,15.1 83.93,15.11 C1.2 83.19,14.86 v83.19,14.21 | v82.04,12.94 81.89,12.79 C4.- v83.31,11.41 | C2.- v85.98,15.22 | C2.- v85.98,12.43 | C2.- 84.56,13.85 v84.45,13.95 | v51.31,33.13 C10.1 50.55,33.27 v50.55,34.15 | U5.10 v51.18,35.29 | C15.1 45.72,42.91 v45.85,42.78 | BOOT.1 47.62,42.91 v47.75,43.04 | U5.19 62.81,45.32 v64.13,45.32 | v66.55,45.7 66.55,46.7 C12.1 66.29,46.96 v66.29,47.73 | U4.10 v54.23,49 | U4.19 v64.26,59.16 | v67.69,60.31 67.56,60.43 C11.2 66.66,59.43 v66.67,59.42
  Top 0.61: U1.39_20 U1.39_7 U1.39_17 | U1.39_15 U1.39_4 | U1.39_12 U1.39_1 | U1.39_10 U1.39_2 | U1.39_13 U1.39_5 U1.39_16 U1.39_6 | U1.39_19 U1.39_9 | U1.39_21 U1.39_8 U1.39_18 | U1.39_14 U1.39_3
  other vias: 30.89,34.65 30.89,32.37 44.09,10.14 8.61,51.19 12.09,49.84 8.61,50.3 15.01,51.11 51.59,30.21 49.81,26.53 59.08,31.22 60.86,31.22 24.28,48.95 19.33,48.95 25.3,47.56 25.22,46.29 18.39,47.86 19.28,46.19 15.98,41.61 14.81,40.34 13.46,41.69 14.76,42.99 12.57,44.74 18.26,32.49 18.31,31.25 19.43,35.67
  pour Top: 0,26.78 20.83,26.78 23.11,24.49 27.18,24.49 30.73,20.94 34.8,20.94 36.58,19.16 36.58,15.35 35.05,13.83 30.73,13.83 29.21,12.3 29.21,9 87.88,9 87.88,62.09 38.86,61.83 38.61,61.83 38.61,44.31 23.88,44.31 23.88,61.83 23.62,62.09 0,62.09
  pour Bottom: 0,26.78 20.83,26.78 23.11,24.49 27.18,24.49 30.73,20.94 34.8,20.94 36.58,19.16 36.58,15.35 35.05,13.83 30.73,13.83 29.21,12.3 29.21,9 87.88,9 87.88,62.09 0,62.09
I2S_BCK  (via drill 0.35)
  Top 0.152: 39.71,48.01 39.72,48.02 | 39.72,48.02 U1.28 | v14.34,43.84 15.49,45 15.49,47.1 16.86,48.47 18.64,48.47 19.1,48.01 v19.3,48.01 | U2.16 20.18,33.63 19.88,33.32 19.84,33.32 19.18,32.65 v19.18,32.49 | v19.23,31 19.23,30.54 18.77,30.08 17.68,30.08 16.92,30.84 13.97,30.84 12.19,29.07 8.13,29.07 6.6,30.59 6.6,32.88 5.84,33.64 4.57,33.64 2.92,35.29 2.92,38.59 4.32,39.99 6.6,39.99 6.98,40.37 6.98,42.65 8.51,44.18 11.68,44.18 12.08,43.78 v12.55,43.78 | v24.27,48.01 24.89,48.01 25.05,48.16 25.55,48.16 25.69,48.02 39.72,48.02
  Bottom 0.152: v24.27,48.01 v19.3,48.01 | v14.34,43.84 14.28,43.78 v12.55,43.78 | v19.18,32.49 19.23,32.44 v19.23,31
I2S_DI  (via drill 0.35)
  Top 0.152: v19.33,45.27 19.33,43.65 v16.79,41.11 | v15.44,39.68 15.38,39.73 13.08,39.73 11.81,41 11.81,42.53 11.18,43.16 9.02,43.16 8,42.15 8,39.73 7.24,38.97 4.83,38.97 3.94,38.08 3.94,35.8 5.08,34.65 6.35,34.65 7.62,33.38 7.62,31.1 8.64,30.08 11.68,30.08 13.46,31.86 19.05,31.86 19.3,31.61 21.34,31.61 21.59,31.86 21.59,34.78 21.45,34.92 U2.1 | v24.27,46.19 24.46,46.19 24.97,45.68 25.55,45.68 26.8,44.43 U1.16
  Bottom 0.152: v24.27,46.19 20.25,46.19 v19.33,45.27 | v16.79,41.11 16.79,41.03 v15.44,39.68
I2S_WS  (via drill 0.35)
  Top 0.152: R13.1 42.76,44.23 U1.25 38.3,44.23 37.72,44.81 37.72,45.7 36.47,46.95 25.05,46.95 24.9,47.1 v24.27,47.1 24.13,47.1 | R15.2 R13.1 | R13.1 43.09,42.93 C15.2 | v19.33,47.1 18.92,47.1 18.79,47.23 16.64,47.23 16.26,46.85 16.26,43.18 v15.42,42.34 | v14.13,41.06 13.83,40.75 12.95,40.75 12.45,41.26 12.45,42.65 11.43,43.67 8.76,43.67 7.49,42.4 7.49,39.99 6.98,39.48 4.57,39.48 3.43,38.34 3.43,35.54 4.83,34.15 6.1,34.15 7.11,33.13 7.11,30.84 8.38,29.57 11.94,29.57 13.72,31.35 17.3,31.35 v17.4,31.25 | v17.35,32.47 18.01,33.13 18.92,33.13 19.18,33.39 U2.14
  Bottom 0.152: v24.27,47.1 v19.33,47.1 | v15.42,42.34 v14.13,41.06 | v17.35,32.47 17.35,31.3 v17.4,31.25
LAT  (via drill 0.35)
  Top 0.152: U5.15 70.36,40.37 70.61,40.11 73.15,40.11 HUB75.14 | HUB12.10 79.5,46.72 78.23,46.72 77.22,45.7 77.22,43.51 v78.28,42.45
  Bottom 0.152: v78.28,42.45 77.22,41.38 HUB75.14
N$1
  Top 1.905: NO.1 13.4,13.39 17.4,17.38 RL1.1
N$2
  Top 1.905: RL1.3 17.72,21.89 NO.2
N$3
  Top 0.152: U2.9 17.28,36.42 16.89,36.81 R4.2
N$4
  Top 0.152: PWR.A R1.2
N$5
  Top 0.152: U2.10 16.85,35.92 R5.1 16.26,35.29 17.14,34.4 17.14,33.13 16.51,32.49 13.21,32.49 11.3,30.59 9.14,30.59 8.26,31.48 8.26,33.76 AUDIO-OUT.1
N$6
  Top 0.152: R6.2 16.04,33.76 R5.2 R4.1 16.04,38.34 R7.2
N$7
  Top 0.152: U2.2 21.46,35.42 22.64,34.23 R8.1
N$8
  Top 0.152: R7.1 11.18,38.34 AUDIO-OUT.5 AUDIO-OUT.3
N$9
  Top 0.152: R10.1 R9.1 21.64,37.19 U2.4
N$10
  Top 0.152: R6.1 13.84,34.44 AUDIO-OUT.4 AUDIO-OUT.2
N$11  (via drill 0.35)
  Top 0.152: U3.14 47.5,23.16 v50.93,26.59 | v50.93,29.57 50.93,30.46 52.7,32.24 v59.11,32.24 | v60.83,32.24 64.1,32.24 BAT.1
  Bottom 0.152: v50.93,26.59 v50.93,29.57 | v59.11,32.24 v60.83,32.24
N$13
  Top 0.152: EN.2 19.15,52.16 19.68,52.69 19.68,55.14 R16.1
N$14
  Top 0.152: R15.1 46.29,47.71 BOOT.2
N$15
  Top 0.152: R17.1 ST.A
N$61
  Top 0.305: RL1.5 31.88,10.9 41.91,10.9 42.67,11.67 42.67,17.26 D1.A | D1.A Q1.3 | RL.C 42.89,17.89 D1.A
N$65
  Top 0.152: R2.2 37.28,24.02 RL.A
OE
  Top 0.152: U5.14 71.37,39.1 HUB75.15 73.41,37.07 83.44,37.07 84.58,38.21 HUB12.1
PRE_A
  Top 0.152: U1.27 40.82,46.77 42.55,48.5 43.43,48.5 46.48,51.55 U4.8
PRE_B
  Top 0.152: U1.26 40.57,45.5 42.8,47.73 43.69,47.73 46.23,50.27 U4.9
PRE_B1
  Top 0.152: U1.33 41.84,54.39 44.07,56.62 U4.4
PRE_B2
  Top 0.152: U1.29 43.11,49.31 46.61,52.81 U4.7
PRE_C
  Top 0.152: U5.2 49.4,45.45 48.65,44.7 48.65,40.16 48.52,40.03 46.73,40.03 45.88,40.88 42.29,40.88 39.94,43.23 U1.24
PRE_CLK
  Top 0.152: U1.14 22.74,43.28 24.13,41.89 35.43,41.89 36.45,40.88 39.5,40.88 41.4,38.97 49.02,38.97 49.78,39.73 49.78,42.4 50.29,42.91 U5.4
PRE_D
  Top 0.152: U5.3 49.2,44.18 48.96,43.94 48.96,40.04 48.65,39.73 41.79,39.73 39.88,41.64 36.45,41.64 35.69,42.4 U1.23
PRE_G1
  Top 0.152: U1.36 42.24,58.2 42.55,57.89 U4.3
PRE_G2
  Top 0.152: U1.30 42.34,50.58 45.85,54.08 U4.6
PRE_LAT
  Top 0.152: U1.13 22.02,45.5 21.46,44.94 21.46,42.53 22.61,41.38 35.18,41.38 36.2,40.37 39.24,40.37 41.15,38.46 49.28,38.46 50.42,39.61 50.42,41 51.05,41.64 U5.5
PRE_OE
  Top 0.152: U5.6 51.31,40.37 51.05,40.11 51.05,39.48 49.53,37.96 40.89,37.96 38.99,39.86 36.07,39.86 35.05,40.88 22.35,40.88 20.95,42.27 20.95,46.08 21.64,46.77 U1.12
PRE_R1
  Top 0.152: U1.37 42.37,59.47 43.05,58.78 49.91,58.78 50.29,59.16 U4.2
PRE_R2
  Top 0.152: U1.31 41.71,51.85 45.21,55.35 U4.5
R1
  Top 0.152: U4.18 66.55,57.89 67.82,56.62 HUB75.1 71.63,57.77 72.14,58.28 75.31,58.28 76.07,57.51 76.07,56.37 77.09,55.35 82.68,55.35 82.96,55.08 82.96,52.71 HUB12.12
R2
  Top 0.152: U4.15 65.41,54.08 67.94,51.55 HUB75.5
RELAY
  Top 0.152: R3.1 47.52,17.04 Q1.1 46.23,18.13 46.23,18.78 45.47,19.54 43.69,19.54 43.05,20.18 43.05,23.22 40.89,25.38 36.83,25.38 36.2,26.02 U6.7
RX
  Top 0.152: DEBUG.2 47.52,59.27 49.63,59.27 50.16,59.8 54.36,59.8 54.48,59.67 54.48,57.51 54.23,57.26 43.18,57.26 41.58,55.66 U1.34
SCL  (via drill 0.35)
  Top 0.152: U1.10 21.52,49.31 19.94,47.73 19.94,41.64 21.72,39.86 28.19,39.86 29.21,38.84 29.21,34.27 29.59,33.89 31.03,33.89 v31.8,34.65 31.12,35.33 U6.14 | I2C.3 48.31,14.84 50.04,14.84 51.31,16.11 51.31,19.29 50.04,20.56 U3.16 50.04,23.35 50.93,24.24 52.32,24.24 53.85,25.76 R11.2 53.12,27.93 51.55,27.93 51.42,27.8 39.62,27.8 36.07,31.35 32.82,31.35 v31.8,32.37
  Bottom 0.152: v31.8,34.65 v31.8,32.37
SD_CLK  (via drill 0.35)
  Top 0.152: U1.8 21.26,51.85 19.81,50.4 14.48,50.4 v14.1,50.78 | v9.45,50.8 9.45,51.36 9.75,51.66 9.75,54.31 10.67,55.23 μSD.5
  Bottom 0.152: v14.1,50.78 9.47,50.78 v9.45,50.8
SD_CS  (via drill 0.35)
  Top 0.152: U6.4 32.38,28.18 32,28.56 26.04,28.56 25.4,29.19 19.68,29.19 19.3,29.57 17.53,29.57 16.89,30.21 14.1,30.21 12.45,28.56 7.87,28.56 6.1,30.34 6.1,32.62 5.59,33.13 4.32,33.13 2.41,35.03 2.41,38.84 4.06,40.5 6.22,40.5 6.48,40.75 6.48,43.42 9.45,46.39 v9.45,49.89 | μSD.2 11.17,51.92 10.92,51.67 10.92,50.09 v11.12,49.89
  Bottom 0.152: v11.12,49.89 v9.45,49.89
SD_DI
  Top 0.152: μSD.3 12.1,52.94 13.08,52.94 13.34,52.69 13.34,50.27 13.72,49.89 20.57,49.89 21.15,50.47 22.63,50.47 U1.9
SD_DO  (via drill 0.35)
  Top 0.152: U1.7 20.75,53.12 20.32,52.69 20.32,51.67 19.42,50.78 16.26,50.78 15.24,51.8 v14.1,51.8 | v9.15,51.94 9.15,54.6 10.54,55.99 10.54,56.75 11.21,57.42 μSD.7
  Bottom 0.152: v14.1,51.8 9.27,51.8 9.27,51.81 v9.15,51.94
SDA  (via drill 0.35)
  Top 0.152: U1.11 21.9,48.04 20.45,46.59 20.45,41.89 21.97,40.37 28.7,40.37 29.84,39.23 U6.15 29.97,36.37 v29.97,34.65 | I2C.2 46.82,15.86 50.16,15.86 50.8,16.49 50.8,19.03 50.29,19.54 49.15,19.54 48.77,19.92 U3.15 48.77,23.22 50.42,24.87 51.56,24.87 52.2,25.51 R12.2 39.33,27.2 35.81,30.72 31.62,30.72 v29.97,32.37
  Bottom 0.152: v29.97,32.37 v29.97,34.65
ST_LED
  Top 0.152: R17.2 26.92,30.59 28.07,29.45 34.42,29.45 34.92,28.94 U6.6
TX
  Top 0.152: DEBUG.3 42.82,61.43 38.46,61.43 37.97,60.94 37.97,57.64 38.68,56.93 U1.35

### Text on the board
tPlace: HUB75 | HUB12 | - | +